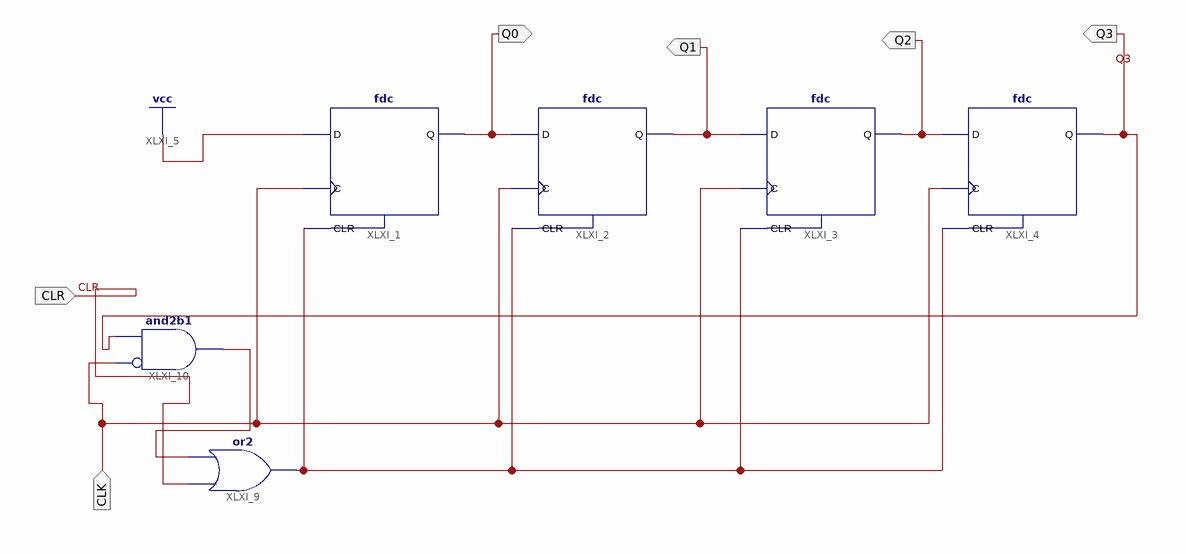
[diagram p0: schematic sheet 1]
// Xilinx ISE schematic p3ej1.sch (artix7) as structural Verilog: 6 symbols, 6 ports
module p3ej1 (
  input  CLK,
  input  CLR,
  output Q1,
  output Q2,
  output Q0,
  output Q3
);

  wire XLXN_18, XLXN_19;

  fdc XLXI_1 (.C(CLK), .CLR(XLXN_19), .D(1'b1), .Q(Q0));
  fdc XLXI_2 (.C(CLK), .CLR(XLXN_19), .D(Q0), .Q(Q1));
  fdc XLXI_3 (.C(CLK), .CLR(XLXN_19), .D(Q1), .Q(Q2));
  fdc XLXI_4 (.C(CLK), .CLR(XLXN_19), .D(Q2), .Q(Q3));
  or XLXI_9 (XLXN_19, CLR, XLXN_18);
  and XLXI_10 (XLXN_18, ~CLK, Q3);  // and2b1
endmodule
